# Altium schematic sheet Sheet1.SchDoc
size A
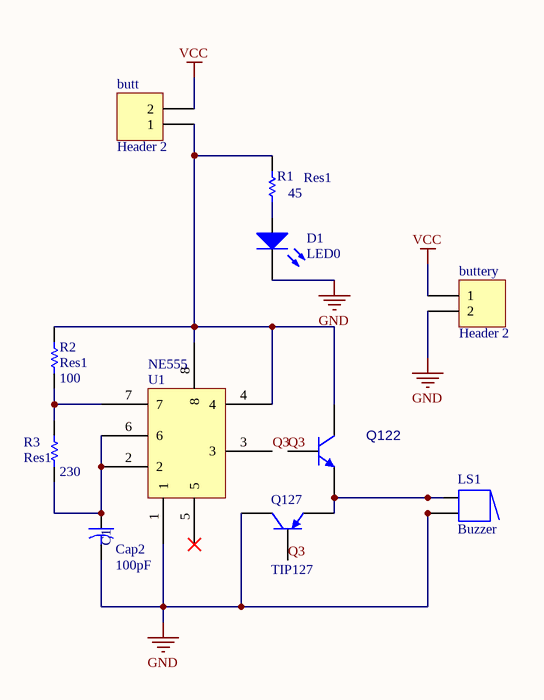
[diagram p0: Sheet1.SchDoc]

## Parts
butt  Header 2  [HDR1X2]
buttery  Header 2  [HDR1X2]
C1  Cap2  value 100pF  [CAPR5-4X5]
D1  LED0  [LED-0]
LS1  Buzzer  [ABSM-1574]
Q122  TIP122  [TIP122]  (value not drawn)
Q127  TIP127  [TIP127]
R1  Res1  value 45  [AXIAL-0.3]
R2  Res1  value 100  [AXIAL-0.3]
R3  Res1  value 230  [AXIAL-0.3]
U1  NE555  [555]

## Nets
GND: buttery.2 C1.2 D1.2(K) LS1.2 LS1.2A Q127.2(C) U1.1
VCC: butt.2 buttery.1
Q3: Q122.1(B) Q127.1(B) U1.3
Netbutt_1: butt.1 Q122.2(C) R1.2 R2.1 U1.4 U1.8
NetC1_1: C1.1 R3.2 U1.2 U1.6
NetD1_1: D1.1(A) R1.1
NetLS1_1: LS1.1 LS1.1A Q122.3(E) Q127.3(E)
NetR2_2: R2.2 R3.1 U1.7

Not connected (* = marked no-connect by the designer): U1 5*

## Library data of the parts
butt buttery = Header 2: Header, 2-Pin; LatestRevisionDate: 17-Jul-2002; LatestRevisionNote: Re-released for DXP Platform.; Publisher: Altium Limited
C1 = Cap2: Capacitor; Published: 23-Sep-2002; PackageReference: CAPR5-4X5; Publisher: Altium Limited; PackageDescription: Capacitor; 2 Leads
D1 = LED0: Typical INFRARED GaAs LED; Published: 8-Jun-2000; LatestRevisionDate: 08-Jul-2005; LatestRevisionNote: Mech Layer 1 removed.; PackageReference: LED-0; Publisher: Altium Limited; PackageDescription: LED; 2 Leads
LS1 = Buzzer: Magnetic Transducer Buzzer; Published: 24-Mar-1999; LatestRevisionDate: 17-Dec-2003; LatestRevisionNote: Schematic revised, PCB Footprint replaced.; DatasheetVersion: 17-Dec-2003; PackageReference: ABSM-1574; Publisher: Altium Limited; PackageDescription: Magnetic Transducer Buzzer; ComponentLink1Description: Manufacturer Link; ComponentLink1URL: http://www.megastar.com/linecard/buzzmode/index.php
Q122 = TIP122: Vendor: STMicroelectronics; Built_By: EMA_UL_Team; SourceLibrary: Update_to_database_2020-11-23; Manufacturer_Part_Number: TIP122
Q127 = TIP127: MF: ON Semiconductor; Value: *; MP: TIP127; SnapEDA_Link: https://www.snapeda.com/parts/TIP127/ON%20Semiconductor/view-part/1991790/?ref=snap; Availability: Unavailable; Package: TO-220-3 Signetics; Price: None
R1-R3 = Res1: Resistor; Published: 8-Jun-2000; LatestRevisionDate: 17-Jul-2002; LatestRevisionNote: Re-released for DXP Platform.; PackageReference: AXIAL-0.3; Publisher: Altium Limited; PackageDescription: Axial Device, Thru-Hole; 2 Leads; 0.3 in Pin Spacing
U1 = 555